# Altium schematic sheet mix1_LO1.SchDoc
size A3
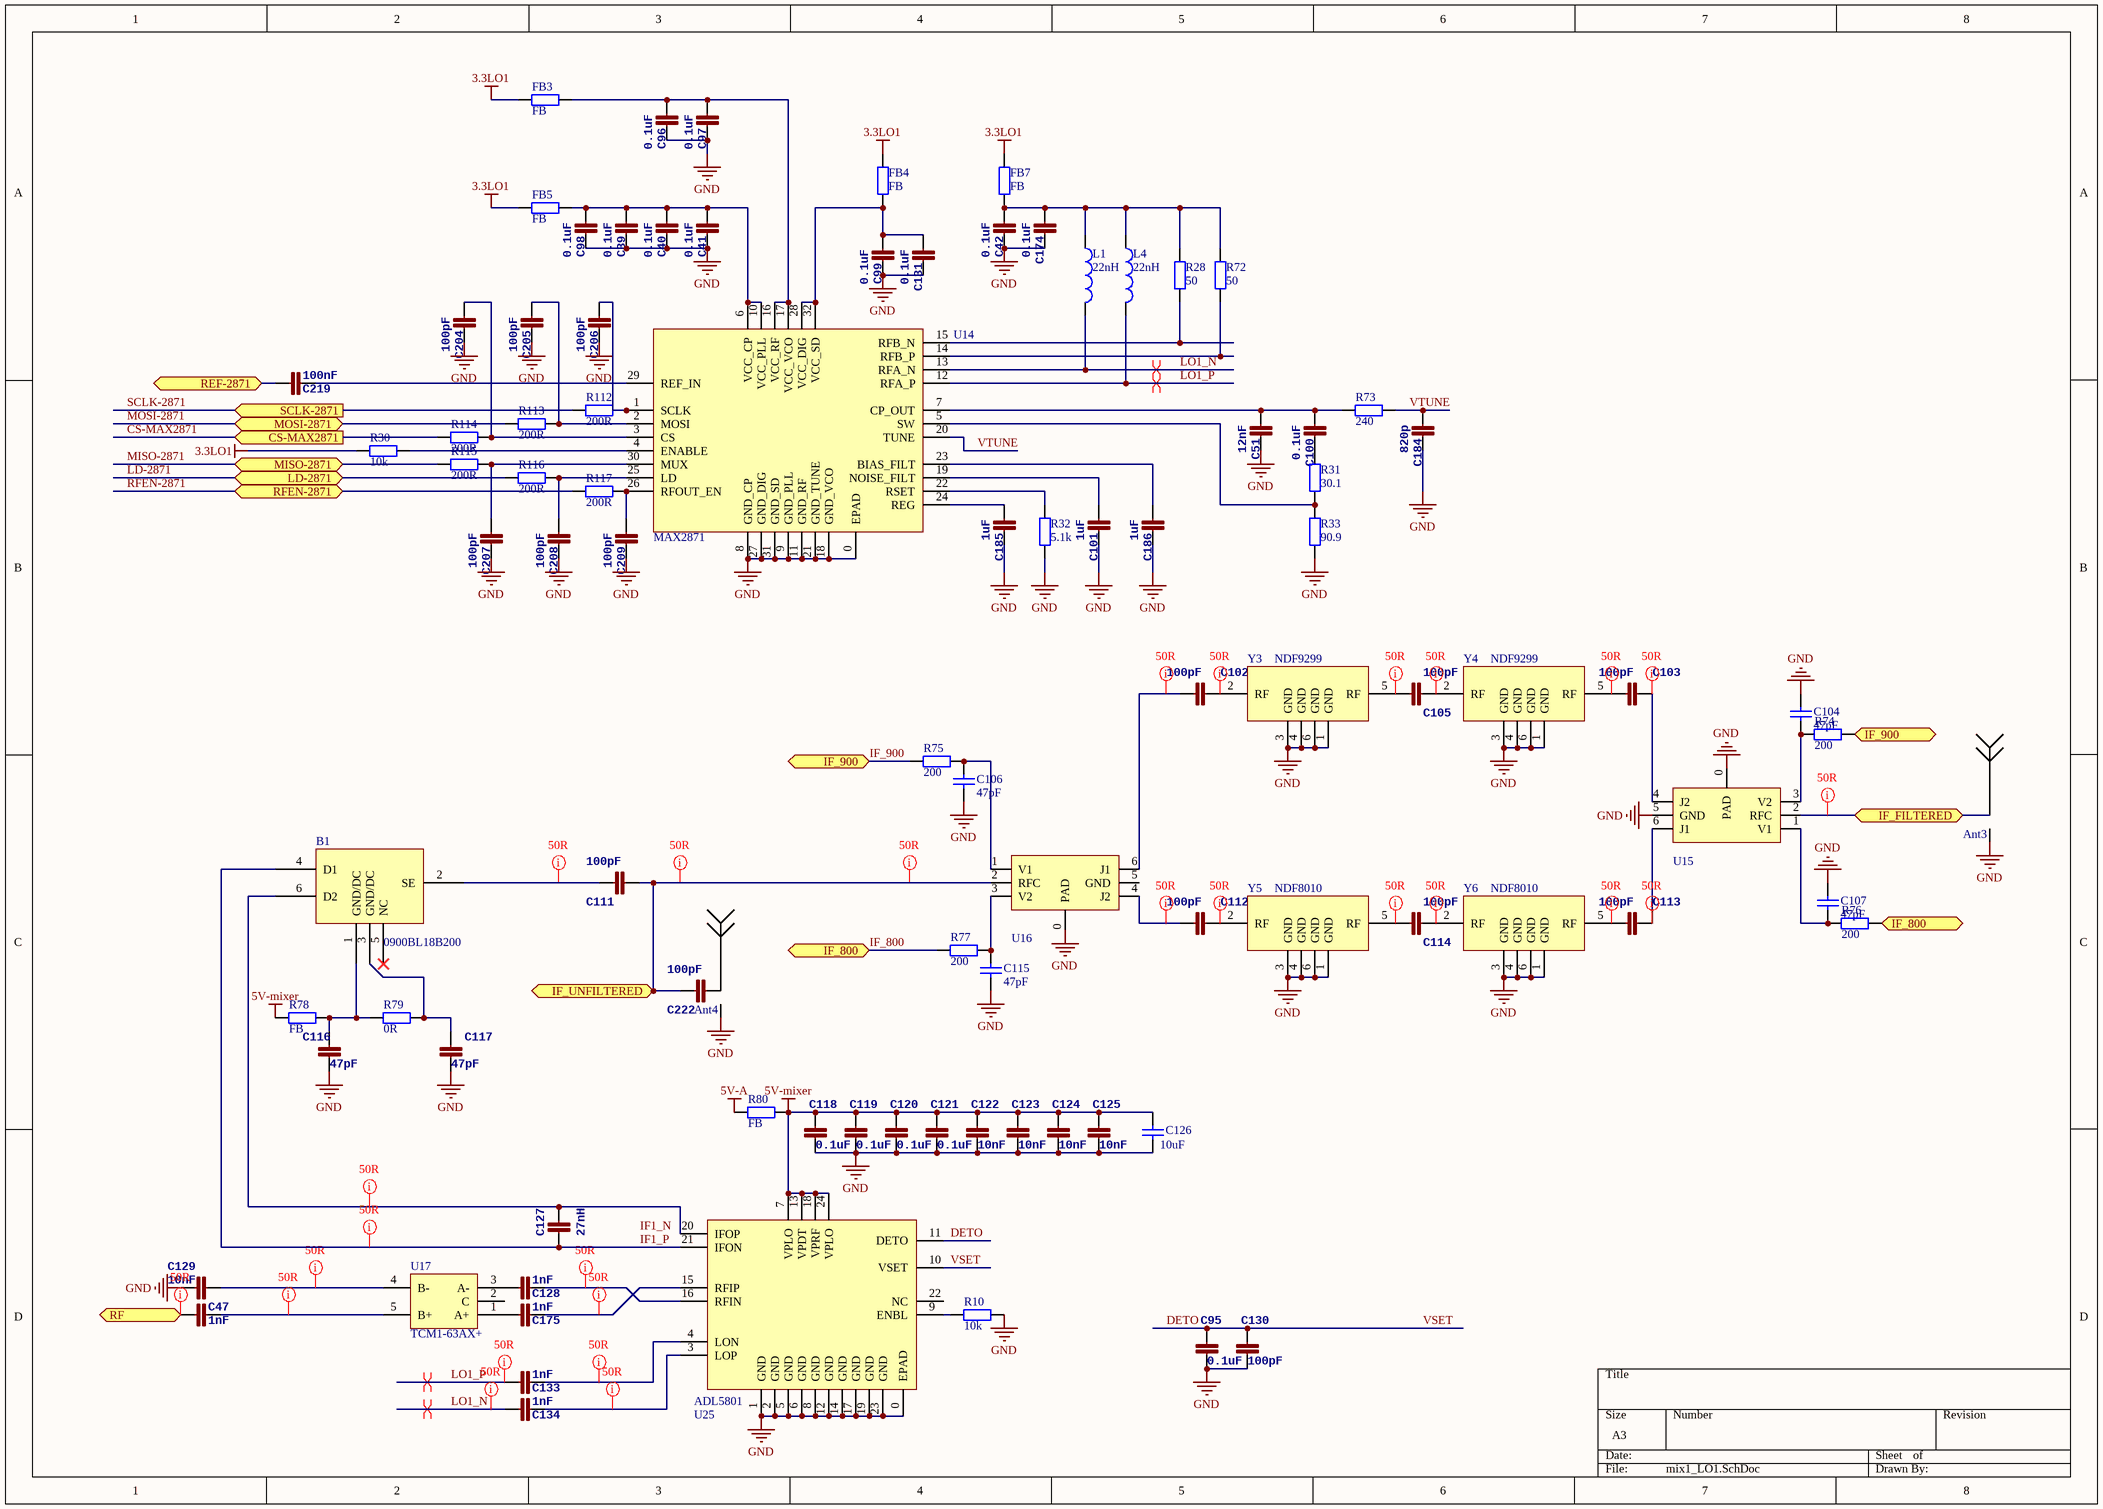
[diagram p0: mix1_LO1.SchDoc]

## Parts
Ant3  Antenna  [SMA-SMT]  (value not drawn)
Ant4  Antenna  [SMA-SMT]  (value not drawn)
B1  0900BL18B200  [0900BL18B200]
C39  0.1uF  [0402]
C40  0.1uF  [0402]
C41  0.1uF  [0402]
C42  0.1uF  [0402]
C47  1nF  [0402]
C51  12nF  [0402]
C95  0.1uF  [0402]
C96  0.1uF  [0402]
C97  0.1uF  [0402]
C98  0.1uF  [0402]
C99  0.1uF  [0402]
C100  0.1uF  [0402]
C101  1uF  [0402]
C102  100pF  [0402]
C103  100pF  [0402]
C104  47pF  [0402]
C105  100pF  [0402]
C106  47pF  [0402]
C107  47pF  [0402]
C111  100pF  [0402]
C112  100pF  [0402]
C113  100pF  [0402]
C114  100pF  [0402]
C115  47pF  [0402]
C116  47pF  [0402]
C117  47pF  [0402]
C118  0.1uF  [0402]
C119  0.1uF  [0402]
C120  0.1uF  [0402]
C121  0.1uF  [0402]
C122  10nF  [0402]
C123  10nF  [0402]
C124  10nF  [0402]
C125  10nF  [0402]
C126  10uF  [0805]
C127  27nH  [0402]
C128  1nF  [0402]
C129  10nF  [0402]
C130  100pF  [0402]
C131  0.1uF  [0402]
C133  1nF  [0402]
C134  1nF  [0402]
C174  0.1uF  [0402]
C175  1nF  [0402]
C184  820p  [0402]
C185  1uF  [0402]
C186  1uF  [0402]
C204  100pF  [0402]
C205  100pF  [0402]
C206  100pF  [0402]
C207  100pF  [0402]
C208  100pF  [0402]
C209  100pF  [0402]
C219  100nF  [0402]
C222  100pF  [0402]
FB3  FB  [0603]
FB4  FB  [0603]
FB5  FB  [0603]
FB7  FB  [0603]
L1  value 22nH  [0402]  (hidden comment: Inductor)
L4  value 22nH  [0402]  (hidden comment: Inductor)
R10  value 10k  [0402]  (hidden comment: Res2)
R28  50  [0402]
R30  10k  [0402]
R31  30.1  [0402]
R32  5.1k  [0402]
R33  90.9  [0402]
R72  50  [0402]
R73  240  [0402]
R74  200  [0402]
R75  200  [0402]
R76  200  [0402]
R77  200  [0402]
R78  FB  [0402]
R79  0R  [0402]
R80  FB  [0603]
R112  200R  [0402]
R113  200R  [0402]
R114  200R  [0402]
R115  200R  [0402]
R116  200R  [0402]
R117  200R  [0402]
U14  MAX2871  [MAX2871]
U15  SKY13320  [SKY65404-31]  (value not drawn)
U16  SKY13320  [SKY65404-31]  (value not drawn)
U17  TCM1-63AX+  [TCM-63AX+]
U25  ADL5801  [ADL5801]
Y3  NDF9299  [NDF8010]
Y4  NDF9299  [NDF8010]
Y5  NDF8010  [NDF8010]
Y6  NDF8010  [NDF8010]

## Ports
CS-MAX2871 (in), IF_800, IF_900, IF_FILTERED, IF_UNFILTERED, LD-2871, MISO-2871, MOSI-2871, REF-2871, RF, RFEN-2871, SCLK-2871 (in)

## Nets
3.3LO1: FB3.2 FB4.1 FB5.2 FB7.1 R30.2
5V-A: R80.1
5V-mixer: C118.2 C119.2 C120.2 C121.2 C122.2 C123.2 C124.2 C125.2 C126.2 R78.1 R80.2 U25.7(VPLO) U25.13(VPDT) U25.18(VPRF) U25.24(VPLO)
GND: Ant3.GND(G) Ant4.GND(G) C39.2 C40.2 C41.2 C42.2 C47.1 C51.2 C95.1 C96.2 C97.2 C98.2 C99.2 C101.2 C104.1 C106.1 C107.1 C115.1 C116.1 C117.1 C118.1 C119.1 C120.1 C121.1 C122.1 C123.1 C124.1 C125.1 C126.1 C130.1 C131.2 C174.2 C184.2 C185.2 C186.2 C204.2 C205.2 C206.2 C207.2 C208.2 C209.2 R10.2 R32.1 R33.1 U14.0(EPAD) U14.8(GND_CP) U14.9(GND_PLL) U14.11(GND_RF) U14.18(GND_VCO) U14.21(GND_TUNE) U14.27(GND_DIG) U14.31(GND_SD) U15.0(PAD) U15.5(GND) U16.0(PAD) U25.0(EPAD) U25.1(GND) U25.2(GND) U25.5(GND) U25.6(GND) U25.8(GND) U25.12(GND) U25.14(GND) U25.17(GND) U25.19(GND) U25.23(GND) Y3.1(GND) Y3.3(GND) Y3.4(GND) Y3.6(GND) Y4.1(GND) Y4.3(GND) Y4.4(GND) Y4.6(GND) Y5.1(GND) Y5.3(GND) Y5.4(GND) Y5.6(GND) Y6.1(GND) Y6.3(GND) Y6.4(GND) Y6.6(GND)
CS-MAX2871: R114.2 ; port CS-MAX2871
DETO: C95.2 C130.2 U25.10(VSET) U25.11(DETO)  [also labelled VSET]
IF1_P: B1.4(D1) C127.2 U25.21(IFON)
IF_800: R76.1 R77.1 ; port IF_800
IF_900: R74.1 R75.1 ; port IF_900
IF_FILTERED: Ant3.1 U15.2(RFC) ; port IF_FILTERED
IF_UNFILTERED: C111.1 C222.2 U16.2(RFC) ; port IF_UNFILTERED
LD-2871: R116.2 ; port LD-2871
LO1_N: C134.1 L1.2 U14.13(RFA_N)
LO1_P: C133.1 L4.2 U14.12(RFA_P)
MISO-2871: R115.2 ; port MISO-2871
MOSI-2871: R113.2 ; port MOSI-2871
REF-2871: C219.1 ; port REF-2871
RF: C129.2 ; port RF
RFEN-2871: R117.2 ; port RFEN-2871
SCLK-2871: R112.2 ; port SCLK-2871
VTUNE: C184.1 R73.1 U14.20(TUNE)
NetAnt4_1: Ant4.1 C222.1
NetB1_1: B1.1(GND/DC) C116.2 R78.2 R79.1
NetB1_2: B1.2(SE) C111.2
NetB1_3: B1.3(GND/DC) C117.2 R79.2
NetB1_6: B1.6(D2) C127.1 U25.20(IFOP)
NetC39_1: C39.1 C40.1 C41.1 C98.1 FB5.1 U14.6(VCC_CP) U14.10(VCC_PLL)
NetC42_1: C42.1 C174.1 FB7.2 L1.1 L4.1 R28.1 R72.1
NetC47_2: C47.2 U17.4(B-)
NetC51_1: C51.1 C100.1 R73.2 U14.7(CP_OUT)
NetC96_1: C96.1 C97.1 FB3.1 U14.16(VCC_RF) U14.17(VCC_VCO)
NetC99_1: C99.1 C131.1 FB4.2 U14.28(VCC_DIG) U14.32(VCC_SD)
NetC100_2: C100.2 R31.2
NetC101_1: C101.1 U14.19(NOISE_FILT)
NetC102_1: C102.1 Y3.2(RF)
NetC102_2: C102.2 U16.6(J1)
NetC103_1: C103.1 U15.4(J2)
NetC103_2: C103.2 Y4.5(RF)
NetC104_2: C104.2 R74.2 U15.3(V2)
NetC105_1: C105.1 Y4.2(RF)
NetC105_2: C105.2 Y3.5(RF)
NetC106_2: C106.2 R75.2 U16.1(V1)
NetC107_2: C107.2 R76.2 U15.1(V1)
NetC112_1: C112.1 Y5.2(RF)
NetC112_2: C112.2 U16.4(J2)
NetC113_1: C113.1 U15.6(J1)
NetC113_2: C113.2 Y6.5(RF)
NetC114_1: C114.1 Y6.2(RF)
NetC114_2: C114.2 Y5.5(RF)
NetC115_2: C115.2 R77.2 U16.3(V2)
NetC128_1: C128.1 U17.3(A-)
NetC128_2: C128.2 U25.16(RFIN)
NetC129_1: C129.1 U17.5(B+)
NetC133_2: C133.2 U25.4(LON)
NetC134_2: C134.2 U25.3(LOP)
NetC175_1: C175.1 U17.1(A+)
NetC175_2: C175.2 U25.15(RFIP)
NetC185_1: C185.1 U14.24(REG)
NetC186_1: C186.1 U14.23(BIAS_FILT)
NetC204_1: C204.1 R114.1 U14.3(CS)
NetC205_1: C205.1 R113.1 U14.2(MOSI)
NetC206_1: C206.1 R112.1 U14.1(SCLK)
NetC207_1: C207.1 R115.1 U14.30(MUX)
NetC208_1: C208.1 R116.1 U14.25(LD)
NetC209_1: C209.1 R117.1 U14.26(RFOUT_EN)
NetC219_2: C219.2 U14.29(REF_IN)
NetR10_1: R10.1 U25.9(ENBL)
NetR28_2: R28.2 U14.15(RFB_N)
NetR30_1: R30.1 U14.4(ENABLE)
NetR31_1: R31.1 R33.2 U14.5(SW)
NetR32_2: R32.2 U14.22(RSET)
NetR72_2: R72.2 U14.14(RFB_P)

Not connected (* = marked no-connect by the designer): B1 5(NC)*; U16 5(GND); U17 2(C); U25 22(NC)

## Layout directives
differential pair: LO1_N, LO1_P
net class 50R: IF1_P, IF_FILTERED, IF_UNFILTERED, LO1_N, LO1_P, NetB1_2, NetB1_6, NetC47_2, NetC102_1, NetC102_2, NetC103_1, NetC103_2, NetC105_1, NetC105_2, NetC112_1, NetC112_2, NetC113_1, NetC113_2, NetC114_1, NetC114_2, NetC128_2, NetC129_1, NetC133_2, NetC134_2, NetC175_2, RF

## Notes on the sheet
- Labels drawn without touching a wire or pin: IF1_N

## Library data of the parts
C39-C42 C47 C51 C95-C103 C105 C111-C114 C116-C125 C127-C131 C133 C134 C174 C175 C184-C186 C204-C209 C219 C222 = CAP0402-CAP: <b>Capacitor</b> / Standard 0603 ceramic capacitor, and 0.1" leaded capacitor.; PARTNO: CC0402ZRY5V7BB104
C104 C106 C107 C115 C126 = Cap: Capacitor; Published: 8-Jun-2000; LatestRevisionDate: 17-Jul-2002; LatestRevisionNote: Re-released for DXP Platform.; PackageReference: RAD-0.3; Publisher: Altium Limited; PackageDescription: Radial Cap, Thru-Hole; 2 Leads; 0.3 in Pin Spacing
FB3-FB5 FB7 R10 R28 R30-R33 R72-R77 R112-R117 = Res2: Resistor; Published: 8-Jun-2000; LatestRevisionDate: 17-Jul-2002; LatestRevisionNote: Re-released for DXP Platform.; PackageReference: AXIAL-0.4; Publisher: Altium Limited; PackageDescription: Axial Device, Thru-Hole; 2 Leads; 0.4 in Pin Spacing
L1 L4 = Inductor: Code_IEC: 1005; Published: 8-Jun-2000; LatestRevisionDate: 29-May-2009; LatestRevisionNote: IPC-7351 Footprint Added.; PackageReference: 0402-A; Publisher: Altium Limited; PackageDescription: Chip Inductor; Code_JEITA: 0402
R78-R80 = Res2: Resistor; Value: 0Ohm; Published: 8-Jun-2000; LatestRevisionDate: 17-Jul-2002; LatestRevisionNote: Re-released for DXP Platform.; PackageReference: AXIAL-0.4; Publisher: Altium Limited; PackageDescription: Axial Device, Thru-Hole; 2 Leads; 0.4 in Pin Spacing
U17 = TCM-63AX+
Y3 Y4 = NDF8010